# Altium schematic sheet Power Distribution - Spare Load Switch.SchDoc: Title
size B; Organization: Midnight Sun Solar Rayce Car Team; Address1: University of Waterloo; Address2: 200 University Ave W; Address3: Waterloo, ON, Canada; Address4: N2L 3E9; DocumentNumber: 12; SheetNumber: 12; SheetTotal: 13; Website: www.uwmidsun.com; ProjectName: ProjectName
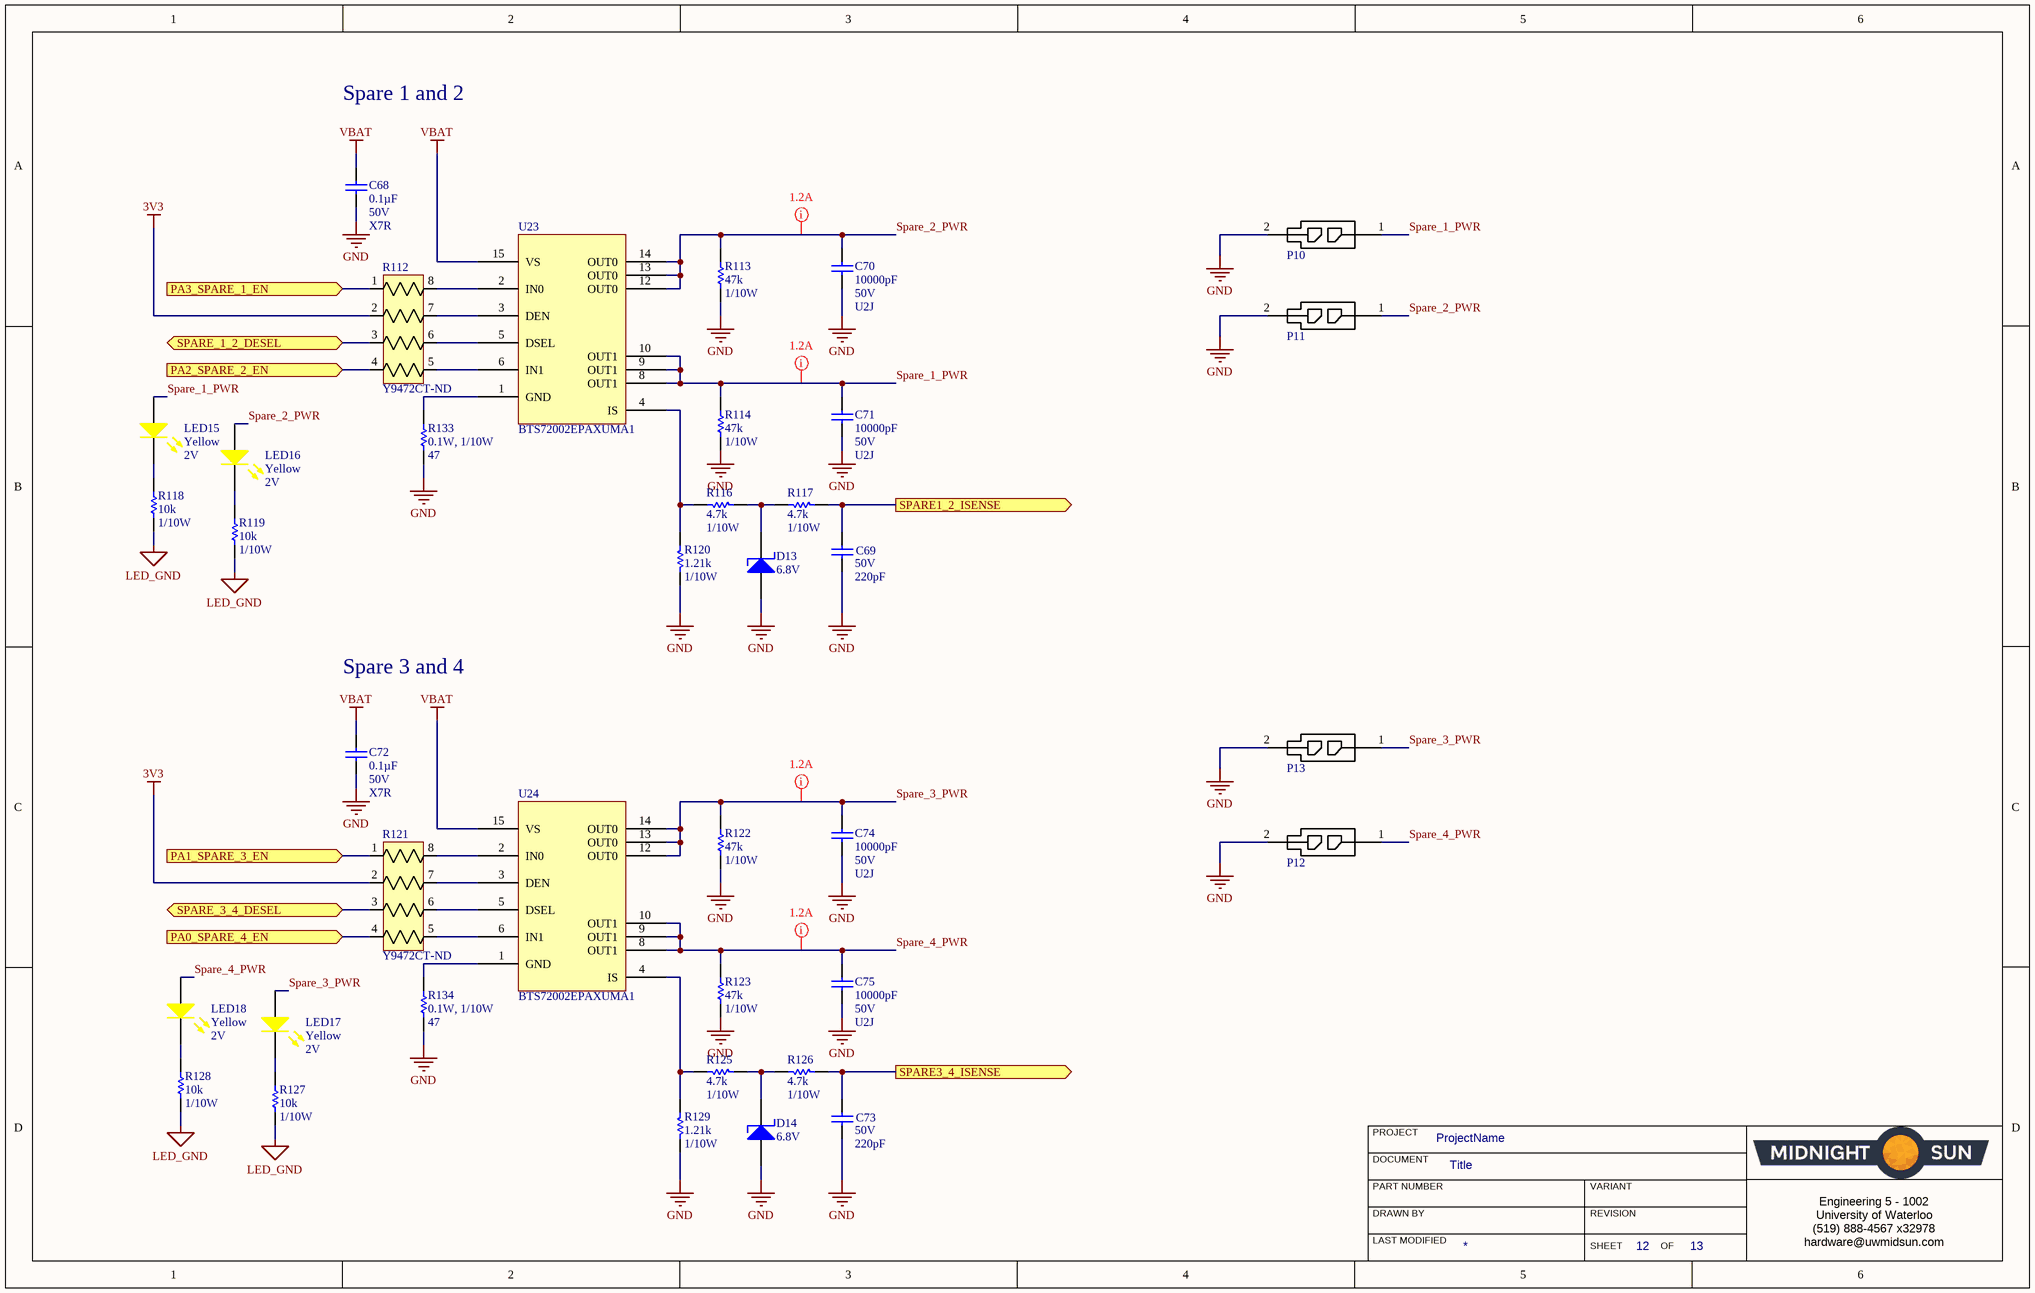
[diagram p0: Power Distribution - Spare Load Switch.SchDoc]

## Parts
C68  Capacitance: 0.1µF  Voltage: 50V  Temperature Coefficient: X7R  [CAP, 0603]  (hidden comment: CAP CER 0.1UF 50V 10% X7R 0603)
C69  Voltage Rating: 50V  Capacitance: 220pF  [CAP, 0603]  (hidden comment: CAP CER 220PF 50V C0G/NP0 0603)
C70  Capacitance: 10000pF  Voltage: 50V  Temperature Coefficient: U2J  [CAP, 0603]  (hidden comment: CAP CER 10nF 50V 5% X7R 0603)
C71  Capacitance: 10000pF  Voltage: 50V  Temperature Coefficient: U2J  [CAP, 0603]  (hidden comment: CAP CER 10nF 50V 5% X7R 0603)
C72  Capacitance: 0.1µF  Voltage: 50V  Temperature Coefficient: X7R  [CAP, 0603]  (hidden comment: CAP CER 0.1UF 50V 10% X7R 0603)
C73  Voltage Rating: 50V  Capacitance: 220pF  [CAP, 0603]  (hidden comment: CAP CER 220PF 50V C0G/NP0 0603)
C74  Capacitance: 10000pF  Voltage: 50V  Temperature Coefficient: U2J  [CAP, 0603]  (hidden comment: CAP CER 10nF 50V 5% X7R 0603)
C75  Capacitance: 10000pF  Voltage: 50V  Temperature Coefficient: U2J  [CAP, 0603]  (hidden comment: CAP CER 10nF 50V 5% X7R 0603)
D13  6.8V  [DIODE SOD123]
D14  6.8V  [DIODE SOD123]
LED15  Color: Yellow  Voltage - Forward (Vf) (Typ): 2V  [LED_0603]  (hidden comment: LED YELLOW CLEAR 2.1V 0603)
LED16  Color: Yellow  Voltage - Forward (Vf) (Typ): 2V  [LED_0603]  (hidden comment: LED YELLOW CLEAR 2.1V 0603)
LED17  Color: Yellow  Voltage - Forward (Vf) (Typ): 2V  [LED_0603]  (hidden comment: LED YELLOW CLEAR 2.1V 0603)
LED18  Color: Yellow  Voltage - Forward (Vf) (Typ): 2V  [LED_0603]  (hidden comment: LED YELLOW CLEAR 2.1V 0603)
P10  CONN 2POS MICRO-FIT 3mm  [CONN, 2POS MICRO-FIT]  (value not drawn)
P11  CONN 2POS MICRO-FIT 3mm  [CONN, 2POS MICRO-FIT]  (value not drawn)
P12  CONN 2POS MICRO-FIT 3mm  [CONN, 2POS MICRO-FIT]  (value not drawn)
P13  CONN 2POS MICRO-FIT 3mm  [CONN, 2POS MICRO-FIT]  (value not drawn)
R112  Supplier Part Number 1: Y9472CT-ND  [RES ARRAY 4RES 1206]  (hidden comment: RES ARRAY 4 RES 4.7K OHM 1206)
R113  Resistance: 47k  Power Rating: 1/10W  [RES, 0603]  (hidden comment: RES 47K OHM 1% 1/10W 0603)
R114  Resistance: 47k  Power Rating: 1/10W  [RES, 0603]  (hidden comment: RES 47K OHM 1% 1/10W 0603)
R116  Resistance (Ohms): 4.7k  Power (Watts): 1/10W  [RES, 0603]  (hidden comment: RES 4.7K OHM 1% 1/10W 0603)
R117  Resistance (Ohms): 4.7k  Power (Watts): 1/10W  [RES, 0603]  (hidden comment: RES 4.7K OHM 1% 1/10W 0603)
R118  Resistance: 10k  Power: 1/10W  [RES, 0603]  (hidden comment: RES 10K OHM 1% 1/10W 0603)
R119  Resistance: 10k  Power: 1/10W  [RES, 0603]  (hidden comment: RES 10K OHM 1% 1/10W 0603)
R120  Resistance: 1.21k  Power: 1/10W  [RES, 0603]  (hidden comment: RES 1.21K OHM 1% 1/10W 0603)
R121  Supplier Part Number 1: Y9472CT-ND  [RES ARRAY 4RES 1206]  (hidden comment: RES ARRAY 4 RES 4.7K OHM 1206)
R122  Resistance: 47k  Power Rating: 1/10W  [RES, 0603]  (hidden comment: RES 47K OHM 1% 1/10W 0603)
R123  Resistance: 47k  Power Rating: 1/10W  [RES, 0603]  (hidden comment: RES 47K OHM 1% 1/10W 0603)
R125  Resistance (Ohms): 4.7k  Power (Watts): 1/10W  [RES, 0603]  (hidden comment: RES 4.7K OHM 1% 1/10W 0603)
R126  Resistance (Ohms): 4.7k  Power (Watts): 1/10W  [RES, 0603]  (hidden comment: RES 4.7K OHM 1% 1/10W 0603)
R127  Resistance: 10k  Power: 1/10W  [RES, 0603]  (hidden comment: RES 10K OHM 1% 1/10W 0603)
R128  Resistance: 10k  Power: 1/10W  [RES, 0603]  (hidden comment: RES 10K OHM 1% 1/10W 0603)
R129  Resistance: 1.21k  Power: 1/10W  [RES, 0603]  (hidden comment: RES 1.21K OHM 1% 1/10W 0603)
R133  Power (Watts): 0.1W, 1/10W  Values: 47  [RES, 0603]  (hidden comment: RES SMD 47 OHM 1% 1/10W 0603)
R134  Power (Watts): 0.1W, 1/10W  Values: 47  [RES, 0603]  (hidden comment: RES SMD 47 OHM 1% 1/10W 0603)
U23  Manufacturer Part Number: BTS72002EPAXUMA1  [IC LOAD SWITCH PG-TSDSO-14-22]  (hidden comment: IC LOAD SWITCH BTS7200-2EPA PG-TSDSO-14_1)
U24  Manufacturer Part Number: BTS72002EPAXUMA1  [IC LOAD SWITCH PG-TSDSO-14-22]  (hidden comment: IC LOAD SWITCH BTS7200-2EPA PG-TSDSO-14_1)

## Ports
PA0_SPARE_4_EN (in), PA1_SPARE_3_EN (in), PA2_SPARE_2_EN (in), PA3_SPARE_1_EN (in), SPARE1_2_ISENSE (out), SPARE3_4_ISENSE (out), SPARE_1_2_DESEL (bidir), SPARE_3_4_DESEL (bidir)

## Nets
3V3: R112.2 R121.2
GND: C68.2 C69.2 C70.2 C71.2 C72.2 C73.2 C74.2 C75.2 D13.2(A) D14.2(A) P10.2 P11.2 P12.2 P13.2 R113.2 R114.2 R120.2 R122.2 R123.2 R129.2 R133.2 R134.2
LED_GND: R118.2 R119.2 R127.2 R128.2
VBAT: C68.1 C72.1 U23.15(VS) U24.15(VS)
PA0_SPARE_4_EN: R121.4 ; port PA0_SPARE_4_EN
PA1_SPARE_3_EN: R121.1 ; port PA1_SPARE_3_EN
PA2_SPARE_2_EN: R112.4 ; port PA2_SPARE_2_EN
PA3_SPARE_1_EN: R112.1 ; port PA3_SPARE_1_EN
SPARE1_2_ISENSE: C69.1 R117.1 ; port SPARE1_2_ISENSE
SPARE3_4_ISENSE: C73.1 R126.1 ; port SPARE3_4_ISENSE
SPARE_1_2_DESEL: R112.3 ; port SPARE_1_2_DESEL
Spare_1_PWR: C71.1 LED15.1(A) P10.1 R114.1 U23.8(OUT1) U23.9(OUT1) U23.10(OUT1)
Spare_2_PWR: C70.1 LED16.1(A) P11.1 R113.1 U23.12(OUT0) U23.13(OUT0) U23.14(OUT0)
SPARE_3_4_DESEL: R121.3 ; port SPARE_3_4_DESEL
Spare_3_PWR: C74.1 LED17.1(A) P13.1 R122.1 U24.12(OUT0) U24.13(OUT0) U24.14(OUT0)
Spare_4_PWR: C75.1 LED18.1(A) P12.1 R123.1 U24.8(OUT1) U24.9(OUT1) U24.10(OUT1)
NetD13_1: D13.1(K) R116.1 R117.2
NetD14_1: D14.1(K) R125.1 R126.2
NetLED15_2: LED15.2(K) R118.1
NetLED16_2: LED16.2(K) R119.1
NetLED17_2: LED17.2(K) R127.1
NetLED18_2: LED18.2(K) R128.1
NetR112_5: R112.5 U23.6(IN1)
NetR112_6: R112.6 U23.5(DSEL)
NetR112_7: R112.7 U23.3(DEN)
NetR112_8: R112.8 U23.2(IN0)
NetR116_2: R116.2 R120.1 U23.4(IS)
NetR121_5: R121.5 U24.6(IN1)
NetR121_6: R121.6 U24.5(DSEL)
NetR121_7: R121.7 U24.3(DEN)
NetR121_8: R121.8 U24.2(IN0)
NetR125_2: R125.2 R129.1 U24.4(IS)
NetR133_1: R133.1 U23.1(GND)
NetR134_1: R134.1 U24.1(GND)

## Layout directives
mark named 1.2A: Spare_1_PWR, Spare_2_PWR, Spare_3_PWR, Spare_4_PWR

## Notes on the sheet
- Spare 1 and 2
- Spare 3 and 4
- PROJECT
- DOCUMENT
- DRAWN BY
- LAST MODIFIED
- PART NUMBER
- REVISION
- SHEET
- VARIANT
- OF
- Engineering 5 - 1002
  University of Waterloo
  (519) 888-4567 x32978
  hardware@uwmidsun.com

## Library data of the parts
C68 C72 = CAP CER 0.1UF 50V 10% X7R 0603: 0.10µF ±10% 50V Ceramic Capacitor X7R 0603 (1608 Metric); Manufacturer 1: AVX Corporation; Manufacturer Part Number 1: 06035C104KAT2A; Supplier 1: Digi-Key; Supplier Part Number 1: 478-5052-1-ND; Packaging: Cut Tape (CT); Part Status: Active; Operating Temperature: -55°C ~ 125°C; Ratings: -; Mounting Type: Surface Mount, MLCC; Package / Case: 0603 (1608 Metric); Size / Dimension: 0.063" L x 0.032" W (1.60mm x 0.81mm); Height - Seated (Max): -; Thickness (Max): 0.035" (0.90mm); Lead Spacing: -; Lead Style: -; ComponentLink1URL: http://datasheets.avx.com/X7RDielectric.pdf; ComponentLink1Description: http://datasheets.avx.com/X7RDielectric.pdf; Tolerance: ±10%
C69 C73 = CAP CER 220PF 50V C0G/NP0 0603: 220pF ±5% 50V Ceramic Capacitor C0G, NP0 0603 (1608 Metric); Manufacturer: KEMET; Manufacturer Part Number: C0603C221J5GACAUTO; Dissipation Factor: 0.1%; Supplier 1: Digi-Key; Supplier Part Number 1: 399-6868-1-ND; Stock 1: 35170; Pricing 1: 1=0.14000, 10=0.09700, 100=0.04550, 500=0.03188, 1000=0.02640 (USD); RoHS: Yes; Mount: Surface Mount; Case/Package: 0603; Case Code (Metric): 1608; Case Code (Imperial): 0603; Contact Plating: Tin; Dielectric Material: Ceramic; Min Operating Temperature: -55°C; Max Operating Temperature: 125°C; Tolerance: 5%; Packaging: Tape and Reel; Package Quantity: 1; Voltage Rating (DC): 50V; Termination: SMD/SMT; Length: 1.6mm; Height: 0.8mm; Width: 0.031inch; Thickness: 0.034inch; Depth: 0.8mm; Ratings: AEC-Q200; Radiation Hardening: No; REACH SVHC: No SVHC; Lead Free: Lead Free; ComponentLink1URL: https://datasheet.ciiva.com/18192/getdatasheetpartid-416741-18192869.pdf?src-supplier=Verical; ComponentLink1Description: https://datasheet.ciiva.com/18192/getdatasheetpartid-416741-18192869.pdf?src-supplier=Verical; ComponentLink2URL: https://datasheet.ciiva.com/22694/1633156-22694015.pdf?src-supplier=Element14; ComponentLink2Description: https://datasheet.ciiva.com/22694/1633156-22694015.pdf?src-supplier=Element14; Dielectric: C0G
C70 C71 C74 C75 = CAP CER 10nF 50V 5% X7R 0603: 10000pF ±5% 50V Ceramic Capacitor U2J 0603 (1608 Metric); Manufacturer 1: KEMET; Manufacturer Part Number 1: C0603C103J5JAC7867; Supplier 1: Digi-Key; Supplier Part Number 1: 399-13384-1-ND; Packaging: Cut Tape (CT); Part Status: Active; Operating Temperature: -55°C ~ 125°C; Ratings: -; Failure Rate: -; Mounting Type: Surface Mount, MLCC; Package / Case: 0603 (1608 Metric); Size / Dimension: 0.063" L x 0.032" W (1.60mm x 0.80mm); Height - Seated (Max): -; Thickness (Max): 0.034" (0.87mm); Lead Spacing: -; Lead Style: -; ComponentLink1URL: http://www.kemet.com/docfinder?Partnumber=C0603C103J5JAC7867; ComponentLink1Description: http://www.kemet.com/docfinder?Partnumber=C0603C103J5JAC7867; Tolerance: ±5%
D13 D14 = DIODE ZENER 6.8V 500MW SOD123: Zener Diode 6.8V 500mW ±5% Surface Mount SOD-123; Manufacturer: Diodes Incorporated; Manufacturer Part Number: MMSZ5235B-7-F; Supplier 1: Digi-Key; RoHS: RoHS Compliant; Category: Discrete Semiconductor Products; Stock 1: 24231; Pricing 1: 1=0.35, 10=0.286, 100=0.1513, 500=0.09956, 1000=0.06769 (CAD); Packaging: Cut Tape (CT); Part Status: Active; Tolerance: ±5%; Operating Temperature: -65°C ~ 150°C; Mounting Type: Surface Mount; Package / Case: SOD-123; Supplier Device Package: SOD-123; Base Part Number: MMSZ5235B; ComponentLink1URL: https://www.diodes.com/assets/Datasheets/ds18010.pdf; ComponentLink1Description: https://www.diodes.com/assets/Datasheets/ds18010.pdf; Supplier Part Number 1: MMSZ5235B-FDICT-ND
LED15-LED18 = LED YELLOW CLEAR 2.1V 0603: Yellow 590nm LED Indication - Discrete 2V 0603 (1608 Metric); Manufacturer: Wurth Electronics Inc.; Manufacturer Part Number: 150060YS75000; Lens Color: Colorless; Millicandela Rating: 120mcd; Lens Style/Size: Rectangle with Flat Top, 1.10mm x 0.70mm; Current - Test: 20mA; Viewing Angle: 140°; Wavelength - Peak: 595nm; Supplier 1: Digi-Key; RoHS: RoHS Compliant; Category: Optoelectronics; Stock 1: 10523; Pricing 1: 1=0.21, 100=0.1617, 500=0.13964 (CAD); Packaging: Cut Tape (CT); Part Status: Active; Lens Transparency: Clear; Mounting Type: Surface Mount; Wavelength - Dominant: 590nm; Features: -; Package / Case: 0603 (1608 Metric); Supplier Device Package: 0603; Size / Dimension: 1.60mm L x 0.80mm W; Height (Max): 0.80mm; ComponentLink1URL: http://katalog.we-online.de/led/datasheet/150060YS75000.pdf; ComponentLink1Description: http://katalog.we-online.de/led/datasheet/150060YS75000.pdf; Supplier Part Number 1: 732-4981-1-ND
P10-P13 = CONN 2POS MICRO-FIT 3mm: Connector Header Through Hole 2 position; Manufacturer: Molex; Manufacturer Part Number: 43045-0227; Number of Positions: 2; Gender: Male; Contact Resistance: 10mR; Number of Ports: 1; Max Voltage Rating (DC): 250.25kV; Current Rating: 5A; Voltage Rating: 600V; Glow Wire Compliant: Compliant; Supplier 1: Digi-Key; Stock 1: 3657; Pricing 1: 1=0.84, 10=0.74, 25=0.6968, 50=0.6676, 100=0.6387, 250=0.5806, 500=0.52254, 1000=0.46448, 2500=0.42094 (USD); Mount: Through Hole; Contact Plating: Tin; Contact Material: Brass; Housing Colour: Black; Housing Material: Thermoplastic; Number of Terminals: 2; Min Operating Temperature: -40°C; Max Operating Temperature: 105°C; Number of Rows: 2; Packaging: Tray; Termination: Solder; Number of Contacts: 2; Orientation: Vertical; Package Quantity: 3168; Number of Circuits: 2; Length: 7.15mm; Pitch: 3mm; Depth: 8.77mm; Row Spacing: 3mm; Radiation Hardening: No; Halogen Free: Low Halogen; ComponentLink1URL: http://www.onlinecomponents.com/productFiles/mf-MOL/307170430450227_pcb_headers.pdf; ComponentLink1Description: http://www.onlinecomponents.com/productFiles/mf-MOL/307170430450227_pcb_headers.pdf; ComponentLink2URL: http://www.mouser.com/ds/2/276/0430450227_PCB_HEADERS-142611.pdf; ComponentLink2Description: http://www.mouser.com/ds/2/276/0430450227_PCB_HEADERS-142611.pdf; ComponentLink3URL: http://uk.rs-online.com/webdocs/13c3/0900766b813c3a46.pdf; ComponentLink3Description: http://uk.rs-online.com/webdocs/13c3/0900766b813c3a46.pdf; ComponentLink4URL: http://www.molex.com/webdocs/datasheets/pdf/en-us/0430450227_PCB_HEADERS.pdf; ComponentLink4Description: http://www.molex.com/webdocs/datasheets/pdf/en-us/0430450227_PCB_HEADERS.pdf; Supplier Part Number 1: WM10657-ND
R112 R121 = RES ARRAY 4 RES 4.7K OHM 1206: 4.7k Ohm ±5% 62.5mW Power Per Element Isolated 4 Resistor Network/Array ±200ppm/°C 1206 (3216 Metric), Convex, Long Side Terminals; Number of Resistors: 4; Applications Automotive: AEC-Q200; Applications: -; Category: Resistors; Circuit Type: Isolated; Part Status: Active; Resistance (Ohms): 4.7k; Tolerance: ±5%; Power Per Element: 62.5mW; Number of Pins: 8; Operating Temperature: -55°C ~ 125°C; Mounting Type: Surface Mount; Package / Case: 1206 (3216 Metric), Convex, Long Side Terminals; Supplier Device Package: 1206; Size / Dimension: 0.126" L x 0.063" W (3.20mm x 1.60mm); Height - Seated (Max): 0.024" (0.60mm); Packaging: Cut Tape (CT); Resistor Matching Ratio: -; Resistor-Ratio-Drift: -; Series: EXB; ComponentLink1Description: https://industrial.panasonic.com/cdbs/www-data/pdf/AOC0000/AOC0000C14.pdf; ComponentLink1URL: https://industrial.panasonic.com/cdbs/www-data/pdf/AOC0000/AOC0000C14.pdf; Supplier 1: Digi-Key; Temperature Coefficient: ±200ppm/°C
R113 R114 R122 R123 = RES 47K OHM 1% 1/10W 0603: 47 kOhms ±1% 0.1W, 1/10W Chip Resistor 0603 (1608 Metric) Automotive AEC-Q200 Thick Film; Manufacturer: Panasonic; Manufacturer Part Number: ERJ3EKF4702V; Voltage Rating: 75V; Temperature Coefficient: 100ppm/°C; Working Voltage: 6V; Max Power Dissipation: 100mW; ComponentLink1URL: https://industrial.panasonic.com/cdbs/www-data/pdf/RDO0000/AOA0000C291.pdf; ComponentLink1Description: https://industrial.panasonic.com/cdbs/www-data/pdf/RDO0000/AOA0000C291.pdf; ComponentLink2URL: https://datasheet.ciiva.com/6138/aoa0000ce2-6138149.pdf?src-supplier=Farnell; ComponentLink2Description: https://datasheet.ciiva.com/6138/aoa0000ce2-6138149.pdf?src-supplier=Farnell; ComponentLink3URL: https://datasheet.ciiva.com/7802/aoa0000ce2-7802421.pdf?src-supplier=Element14; ComponentLink3Description: https://datasheet.ciiva.com/7802/aoa0000ce2-7802421.pdf?src-supplier=Element14; ComponentLink4URL: https://datasheet.ciiva.com/48531/aoa0000ce2-48531029.pdf?src-supplier=Avnet; ComponentLink4Description: https://datasheet.ciiva.com/48531/aoa0000ce2-48531029.pdf?src-supplier=Avnet; ComponentLink5URL: https://datasheet.ciiva.com/16514/aoa0000ce2-16514071.pdf?src-supplier=Avnet+Asia; ComponentLink5Description: https://datasheet.ciiva.com/16514/aoa0000ce2-16514071.pdf?src-supplier=Avnet+Asia; ComponentLink6URL: https://datasheet.ciiva.com/46398/1678782-46398088.pdf?src-supplier=Element14; ComponentLink6Description: https://datasheet.ciiva.com/46398/1678782-46398088.pdf?src-supplier=Element14; ComponentLink7URL: https://datasheet.ciiva.com/24069/aoa0000ce2-24069209.pdf?src-supplier=Mouser; ComponentLink7Description: https://datasheet.ciiva.com/24069/aoa0000ce2-24069209.pdf?src-supplier=Mouser; ComponentLink8URL: https://datasheet.ciiva.com/46398/1678782-46398089.pdf?src-supplier=Element14; ComponentLink8Description: https://datasheet.ciiva.com/46398/1678782-46398089.pdf?src-supplier=Element14; ComponentLink9URL: https://datasheet.ciiva.com/30236/aoa0000ce2-30236698.pdf?src-supplier=Onlinecomponents.com; ComponentLink9Description: https://datasheet.ciiva.com/30236/aoa0000ce2-30236698.pdf?src-supplier=Onlinecomponents.com; ComponentLink10URL: https://datasheet.ciiva.com/22722/426256-22722781.pdf?src-supplier=Element14; ComponentLink10Description: https://datasheet.ciiva.com/22722/426256-22722781.pdf?src-supplier=Element14; ComponentLink11URL: https://datasheet.ciiva.com/16758/70260748-16758831.pdf?src-supplier=Allied+Electronics; ComponentLink11Description: https://datasheet.ciiva.com/16758/70260748-16758831.pdf?src-supplier=Allied+Electronics; Supplier 1: Digi-Key; Stock 1: 1704740; Pricing 1: 1 = 0.100000, 10 = 0.065000, 100 = 0.026400, 1000 = 0.011860, 2500 = 0.010290 (USD); RoHS: Yes; Mount: Surface Mount; Case/Package: 0603; Number of Pins: 2; Case Code (Metric): 1608; Case Code (Imperial): 0603; Contact Plating: Tin; Min Operating Temperature: -55°C; Max Operating Temperature: 155°C; Tolerance: 1%; Packaging: Tape and Reel; Package Quantity: 1; Composition: Thick Film; Number of Terminations: 2; Termination: SMD/SMT; Military Standard: Not; Voltage Rating (DC): 75V; Features: Automotive AEC-Q200; Length: 1.6mm; Height: 0.022inch; Width: 0.031inch; Depth: 0.8mm; Radiation Hardening: No; REACH SVHC: No SVHC; Lead Free: Lead Free; Supplier Part Number 1: P47.0KHCT-ND
R116 R117 R125 R126 = RES 4.7K OHM 1% 1/10W 0603: 4.7k Ohm ±1% 0.1W, 1/10W Chip Resistor 0603 (1608 Metric) Moisture Resistant Thick Film; Manufacturer 1: Yageo; Manufacturer Part Number 1: RC0603FR-074K7L; Description 1: RES SMD 4.7K OHM 1% 1/10W 0603; Temperature Coefficient: ±100ppm/°C; Supplier 1: Digi-Key; Supplier Part Number 1: 311-4.70KHRCT-ND; RoHS: RoHS Compliant; Category: Resistors; Stock 1: 3487566; Pricing 1: 1=0.16, 10=0.022, 100=0.0089, 1000=0.00402, 2500=0.00349 (CAD); Packaging: Cut Tape (CT); Part Status: Active; Composition: Thick Film; Features: Moisture Resistant; Operating Temperature: -55°C ~ 155°C; Package / Case: 0603 (1608 Metric); Supplier Device Package: 0603; Size / Dimension: 0.063" L x 0.031" W (1.60mm x 0.80mm); Height - Seated (Max): 0.022" (0.55mm); Failure Rate: -; ComponentLink1URL: http://www.yageo.com/documents/recent/PYu-RC_Group_51_RoHS_L_7.pdf; ComponentLink1Description: http://www.yageo.com/documents/recent/PYu-RC_Group_51_RoHS_L_7.pdf; Tolerance: ±1%
R118 R119 R127 R128 = RES 10K OHM 1% 1/10W 0603: RES SMD 10K OHM 1% 1/10W 0603; Manufacturer 1: Yageo; Manufacturer Part Number 1: RC0603FR-0710KL; Temperature Coefficient: ±100ppm/°C; Supplier 1: Digi-Key; Supplier Part Number 1: 311-10.0KHRCT-ND; Packaging: Cut Tape (CT); Part Status: Active; Composition: Thick Film; Operating Temperature: -55°C ~ 155°C; Package / Case: 0603 (1608 Metric); Supplier Device Package: 0603; Size / Dimension: 0.063" L x 0.031" W (1.60mm x 0.80mm); Height - Seated (Max): 0.022" (0.55mm); Failure Rate: -; ComponentLink1URL: http://www.yageo.com/documents/recent/PYu-RC_Group_51_RoHS_L_7.pdf; ComponentLink1Description: http://www.yageo.com/documents/recent/PYu-RC_Group_51_RoHS_L_7.pdf; Tolerance: ±1%
R120 R129 = RES 1.21K OHM 1% 1/10W 0603: 1.21k Ohm ±1% 0.1W, 1/10W Chip Resistor 0603 (1608 Metric) Moisture Resistant Thick Film; Manufacturer 1: Yageo; Manufacturer Part Number 1: RC0603FR-071K21L; Temperature Coefficient: ±100ppm/°C; Supplier 1: Digi-Key; Supplier Part Number 1: 311-1.21KHRCT-ND; Packaging: Cut Tape (CT); Part Status: Active; Composition: Thick Film; Operating Temperature: -55°C ~ 155°C; Package / Case: 0603 (1608 Metric); Supplier Device Package: 0603; Size / Dimension: 0.063" L x 0.031" W (1.60mm x 0.80mm); Height - Seated (Max): 0.022" (0.55mm); Failure Rate: -; ComponentLink1URL: http://www.yageo.com/documents/recent/PYu-RC_Group_51_RoHS_L_7.pdf; ComponentLink1Description: http://www.yageo.com/documents/recent/PYu-RC_Group_51_RoHS_L_7.pdf; Tolerance: ±1%
R133 R134 = RES SMD 47 OHM 1% 1/10W 0603: 47 Ohms ±1% 0.1W, 1/10W Chip Resistor 0603 (1608 Metric) Automotive AEC-Q200, Moisture Resistant Thick Film; Temperature Coefficient: ±100ppm/°C; Resistance: 47 Ohms; Operating Temperature: -55°C ~ 155°C; Features: Automotive AEC-Q200, Moisture Resistant; Tolerance: ±1%; Composition: Thick Film; Ratings: AEC-Q200; Package / Case: 0603 (1608 Metric); Number of Terminations: 2; Height - Seated (Max): 0.022" (0.55mm); Size / Dimension: 0.063" L x 0.031" W (1.60mm x 0.80mm); ComponentLink1Description: https://www.yageo.com/upload/media/product/productsearch/datasheet/rchip/PYu-AC_51_RoHS_L_7.pdf; ComponentLink1URL: https://www.yageo.com/upload/media/product/productsearch/datasheet/rchip/PYu-AC_51_RoHS_L_7.pdf; Supplier 1: Digi-Key; Supplier Part Number 1: 311-47LDCT-ND; Supplier Device Package: 0603
U23 U24 = IC LOAD SWITCH BTS7200-2EPA PG-TSDSO-14_1: Power Switch/Driver 1:1 N-Channel 1.2A PG-TSDSO-14-22; Manufacturer: Infineon; Supplier 1: Digi-Key; Supplier Part Number 1: BTS72002EPAXUMA1CT-ND; Stock 1: 1973; Pricing 1: 1=1.31000, 10=1.17500, 100=0.91640, 500=0.75700, 1000=0.59763 (USD); RoHS: No; ComponentLink1Description: https://www.infineon.com/dgdl/Infineon-BTS7200-2EPA-DS-v01_00-EN.pdf?fileId=5546d462636cc8fb016421e548a61215; ComponentLink1URL: https://www.infineon.com/dgdl/Infineon-BTS7200-2EPA-DS-v01_00-EN.pdf?fileId=5546d462636cc8fb016421e548a61215